# Altium schematic sheet Headers.SchDoc
size A; SheetNumber: 10; SheetTotal: 10
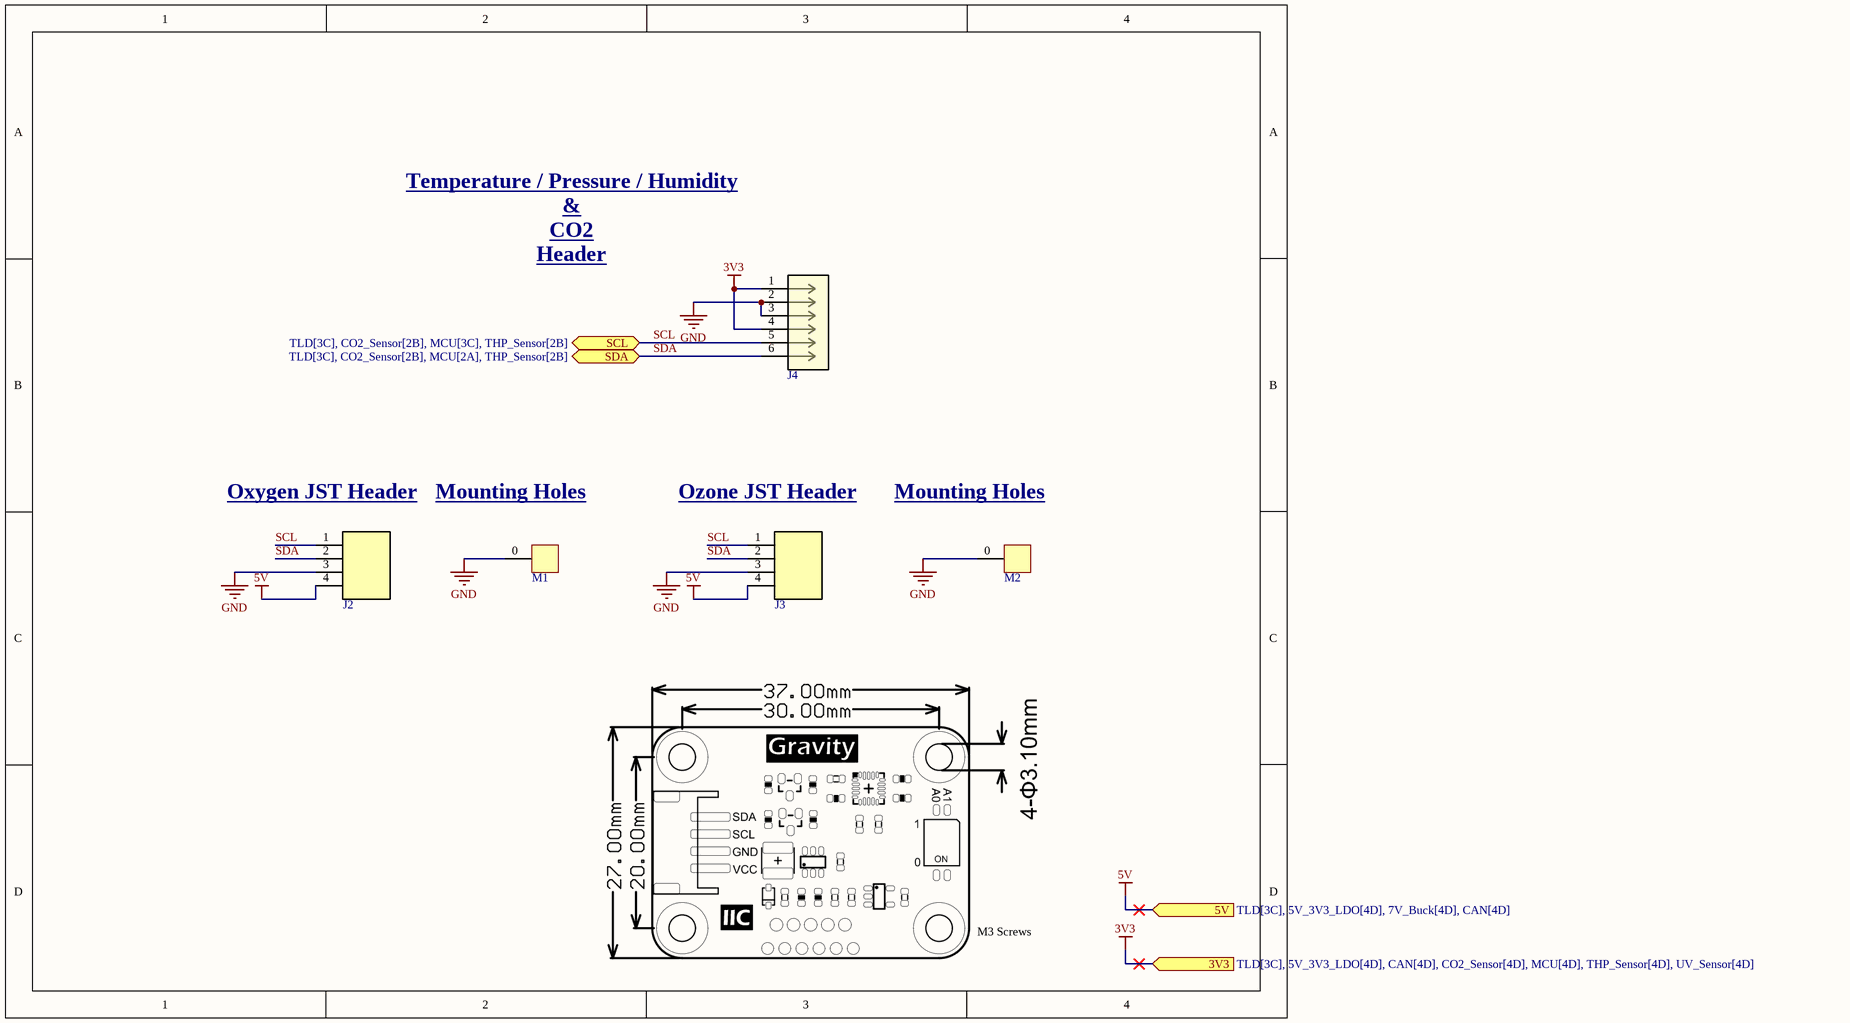
[diagram p0: Headers.SchDoc]

## Parts
J2  S4B-PH-SM4-TB  [JST_S4B-PH-SM4-TB]  (value not drawn)
J3  S4B-PH-SM4-TB  [JST_S4B-PH-SM4-TB]  (value not drawn)
J4  430450600  [CONN_SD-43045-001_06_MOL]  (value not drawn)
M1  DK-Oxygen  [DK-Oxygen]  (value not drawn)
M2  DK-Ozone  [DK-Ozone]  (value not drawn)

## Ports
3V3 (in, see TLD[3C], 5V_3V3_LDO[4D], CAN[4D], CO2_Sensor[4D], MCU[4D], THP_Sensor[4D], UV_Sensor[4D]), 5V (in, see TLD[3C], 5V_3V3_LDO[4D], 7V_Buck[4D], CAN[4D]), SCL (bidir, see TLD[3C], CO2_Sensor[2B], MCU[3C], THP_Sensor[2B]), SDA (bidir, see TLD[3C], CO2_Sensor[2B], MCU[2A], THP_Sensor[2B])

## Nets
3V3: J4.1 J4.4 ; port 3V3
5V: J2.4 J3.4 ; port 5V
GND: J2.3 J3.3 J4.2 J4.3 M1.0 M2.0
SCL: J2.1 J3.1 J4.5 ; port SCL
SDA: J2.2 J3.2 J4.6 ; port SDA

## Notes on the sheet
- (near J4) Temperature / Pressure / Humidity
  &
  CO2
  Header
- (near J2) Oxygen JST Header
- (near M1) Mounting Holes
- (near J3) Ozone JST Header
- (near M2) Mounting Holes
- M3 Screws

## Library data of the parts
J2 J3 = CONN-4POS-JST-0001: Connector Header Surface Mount, Right Angle 4 position 0.079 (2.00mm); MF: JST Sales; SnapEDA_Link: https://www.snapeda.com/parts/S4B-PH-SM4-TB/JST/view-part/?ref=snap; Package: None; Value: *; MP: S4B-PH-SM4-TB; Check_prices: https://www.snapeda.com/parts/S4B-PH-SM4-TB/JST/view-part/?ref=eda; ComponentLink1Description: Datasheet; ComponentLink1URL: https://www.jst-mfg.com/product/pdf/eng/ePH.pdf
J4 = CONN_6POS_430450600: Micro-Fit 3.0 Right-Angle Header, 3.00mm Pitch, Dual Row, 6 Circuits, with Snap-in Plastic Peg PCB Lock, Tin, Glow-Wire Capable, Black; Manufacturer_Name: Molex Connector Corporation; Copyright: Copyright (C) 2025 Ultra Librarian. All rights reserved.; Manufacturer_Part_Number: 430450600; RefDes: RefDes; Type: Type